# Altium schematic sheet 1_P1.schdoc
size 307 x 218 mm; Symbol: Drawing-Symbol_A4; Device: Drawing-Symbol_A4; @Project Name: usb hub; @Page Count: 1; @Update Date: 2026-03-18; @Create Date: 2026-03-17; @Schematic Name: Schematic1; @Page No: 1; @Page Name: P1; Company: EasyEDA.com; Version: V1.0; Page Size: A4; @Create Time: 23:33:04; @Update Time: 17:45:21; Width: 1170; Height: 825; Region Start: 1; X Region Count: 6; Y Region Count: 4; Blade Width: 10; Title Block Position: 3; @Board Name: Board1
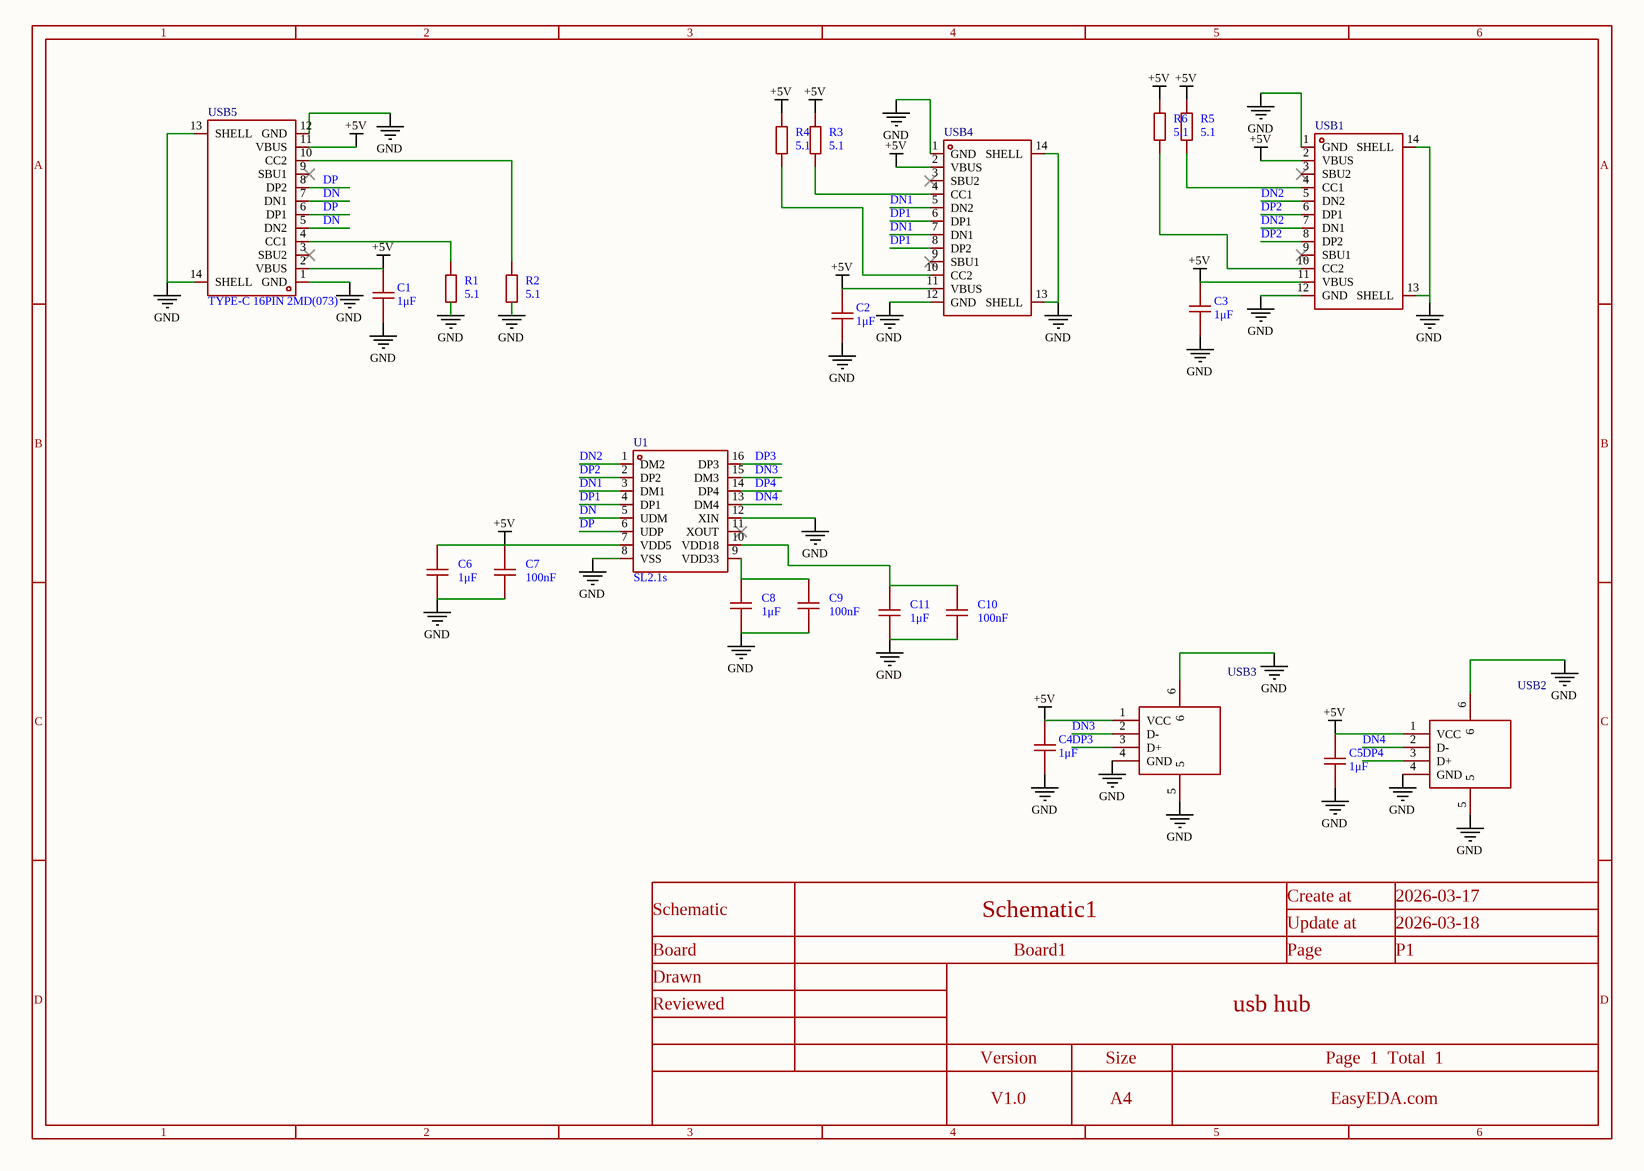
[diagram p0: 1_P1.schdoc]

## Parts
C1  1μF  [C0603]
C2  1μF  [C0603]
C3  1μF  [C0603]
C4  1μF  [C0603]
C5  1μF  [C0603]
C6  1μF  [C0603]
C7  100nF  [C0603]
C8  1μF  [C0603]
C9  100nF  [C0603]
C10  100nF  [C0603]
C11  1μF  [C0603]
R1  5.1  [R0603]
R2  5.1  [R0603]
R3  5.1  [R0603]
R4  5.1  [R0603]
R5  5.1  [R0603]
R6  5.1  [R0603]
U1  SL2.1s  [SSOP-16_L4.6-W2.6-P0.53-LS4.0-BL]
USB1  TYPE-C 16PIN 2MD(073)  [USB-C-SMD_TYPE-C-6PIN-2MD-073]  (value not drawn)
USB2  10.0 QHHTZB6.3  [USB-A-TH_10.0QHHTZB6.3]  (value not drawn)
USB3  10.0 QHHTZB6.3  [USB-A-TH_10.0QHHTZB6.3]  (value not drawn)
USB4  TYPE-C 16PIN 2MD(073)  [USB-C-SMD_TYPE-C-6PIN-2MD-073]  (value not drawn)
USB5  TYPE-C 16PIN 2MD(073)  [USB-C-SMD_TYPE-C-6PIN-2MD-073]

## Nets
+5V: C1.1 C2.1 C3.1 C4.1 C5.1 C6.1 C7.1 R3.2 R4.2 R5.2 R6.2 U1.7(VDD5) USB1.2(VBUS) USB1.11(VBUS) USB2.1(VCC) USB3.1(VCC) USB4.2(VBUS) USB4.11(VBUS) USB5.2(VBUS) USB5.11(VBUS)
GND: C1.2 C2.2 C3.2 C4.2 C5.2 C6.2 C7.2 C8.2 C9.2 C10.2 C11.2 R1.1 R2.1 U1.8(VSS) U1.12(XIN) USB1.1(GND) USB1.12(GND) USB1.13(SHELL) USB1.14(SHELL) USB2.4(GND) USB2.5 USB2.6 USB3.4(GND) USB3.5 USB3.6 USB4.1(GND) USB4.12(GND) USB4.13(SHELL) USB4.14(SHELL) USB5.1(GND) USB5.12(GND) USB5.13(SHELL) USB5.14(SHELL)
DN: U1.5(UDM) USB5.5(DN2) USB5.7(DN1)
DN1: U1.3(DM1) USB4.5(DN2) USB4.7(DN1)
DN2: U1.1(DM2) USB1.5(DN2) USB1.7(DN1)
DN3: U1.15(DM3) USB3.2(D-)
DN4: U1.13(DM4) USB2.2(D-)
DP: U1.6(UDP) USB5.6(DP1) USB5.8(DP2)
DP1: U1.4(DP1) USB4.6(DP1) USB4.8(DP2)
DP2: U1.2(DP2) USB1.6(DP1) USB1.8(DP2)
DP3: U1.16(DP3) USB3.3(D+)
DP4: U1.14(DP4) USB2.3(D+)
NetC8_1: C8.1 C9.1 U1.9(VDD33)
NetC10_1: C10.1 C11.1 U1.10(VDD18)
NetR1_2: R1.2 USB5.4(CC1)
NetR2_2: R2.2 USB5.10(CC2)
NetR3_1: R3.1 USB4.4(CC1)
NetR4_1: R4.1 USB4.10(CC2)
NetR5_1: R5.1 USB1.4(CC1)
NetR6_1: R6.1 USB1.10(CC2)

Not connected (* = marked no-connect by the designer): U1 11(XOUT)*; USB1 3(SBU2)* 9(SBU1)*; USB4 3(SBU2)* 9(SBU1)*; USB5 3(SBU2)* 9(SBU1)*

## Notes on the sheet
- 1
- 2
- 3
- 4
- 5
- 6
- A
- B
- C
- Schematic
- Schematic1
- Create at
- Update at
- 2026-03-17
- 2026-03-18
- Board
- Drawn
- Board1
- Page
- P1
- D
- Reviewed
- Version
- Size
- usb hub
- Page  1  Total  1
- V1.0
- A4
- EasyEDA.com

## Library data of the parts
C1-C11 = CAP_0603: Symbol: CAP; Convert to PCB: yes; Device: CAP_0603; Add into BOM: yes; Supplier Footprint: 0603
  C1-C6 C8 C11: Value: 1μF
  C7 C9 C10: Value: 100nF
R1-R6 = Res_0603: Symbol: Res; Convert to PCB: yes; Device: Res_0603; Add into BOM: yes; Supplier Footprint: 0603; Value: 5.1
U1 = SL2.1s: Manufacturer: CoreChips(和芯润德); Add into BOM: yes; USB Protocol: USB 2.0; Voltage - Supply: 4V~5.25V; Current - Supply: 120mA; Quiescent Supply Current: 2.5mA; Number of Channels: 4; Symbol: SL2.1S; Device: SL2.1s; LCSC Part Name: USB2.0 HUB控制器集成电路; Supplier Part: C2684433; Manufacturer Part: SL2.1s; Supplier Footprint: SSOP-16; JLCPCB Part Class: Extended Part; Datasheet: https://item.szlcsc.com/datasheet/SL2.1s/2782346.html; Supplier: LCSC; Convert to PCB: yes; type: Hub; Operating Temperature: 0℃~+70℃
USB1 USB4 USB5 = TYPE-C 16PIN 2MD(073): Manufacturer: SHOU HAN(首韩); Add into BOM: yes; Gender: Female; Number of Contacts: 16P; Number of Ports: 1; Current Rating-Power: 3A; Voltage Rating: 5V; Connect-Disconnect Life: 5,000 times; Detection color: Black; Symbol: TYPE-C 16PIN 2MD(073); Device: TYPE-C 16PIN 2MD(073); LCSC Part Name: 16P卧贴母座; Supplier Part: C2765186; Manufacturer Part: TYPE-C 16PIN 2MD(073); Supplier Footprint: SMD; JLCPCB Part Class: Extended Part; Datasheet: https://item.szlcsc.com/datasheet/TYPE-C%252016PIN%25202MD(073)/2901843.html; Supplier: LCSC; Convert to PCB: yes; Connector Type: Type-C; Protocol Standard: -; Mounting Type: Surface Mount, Right Angle; Supplementary Features: -; Center Height: -; Length: -; Operating Temperature: -25℃~+85℃
USB2 USB3 = 10.0 QHHTZB6.3: Manufacturer: SHOU HAN(首韩); Add into BOM: yes; Connector Type: Type-A; Protocol Standard: USB 2.0; Gender: Female; Number of Contacts: 4P; Number of Ports: 1; Current Rating-Power: 1.5A; Voltage Rating: 30V; Connect-Disconnect Life: 5,000 times; Detection color: Black; Symbol: 10.0 QHHTZB6.3; Device: 10.0 QHHTZB6.3; LCSC Part Name: 壳长10.0mm; Supplier Part: C668591; Manufacturer Part: 10.0 QHHTZB6.3; Supplier Footprint: SMD; JLCPCB Part Class: Extended Part; Datasheet: https://item.szlcsc.com/datasheet/10.0%2520QHHTZB6.3/698534.html; Supplier: LCSC; Convert to PCB: yes; Mounting Type: Surface Mount, Right Angle; Supplementary Features: -; Center Height: -; Length: 10mm; Operating Temperature: -25℃~+85℃